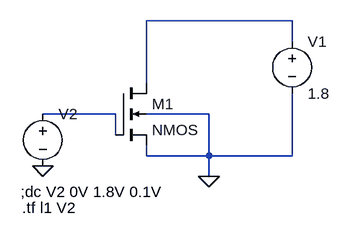
[diagram p0: schematic learning.asc]
learning.asc, the LTspice schematic file:
Version 4
SHEET 1 880 680
WIRE 384 32 160 32
WIRE 384 64 384 32
WIRE 160 128 160 32
WIRE 112 176 0 176
WIRE 256 176 160 176
WIRE 112 208 112 176
WIRE 160 240 160 224
WIRE 256 240 256 176
WIRE 256 240 160 240
WIRE 384 240 384 144
WIRE 384 240 256 240
WIRE 256 272 256 240
FLAG 256 272 0
FLAG 0 256 0
SYMBOL nmos4 112 128 R0
SYMATTR InstName M1
SYMATTR Value2 l=180 w=400
SYMBOL voltage 384 48 R0
WINDOW 123 0 0 Left 0
WINDOW 39 0 0 Left 0
SYMATTR InstName V1
SYMATTR Value 1.8
SYMBOL voltage 0 160 R0
WINDOW 123 0 0 Left 0
WINDOW 39 0 0 Left 0
SYMATTR InstName V2
SYMATTR Value ""
TEXT -34 296 Left 2 !;dc V2 0V 1.8V 0.1V
TEXT -32 320 Left 2 !.tf l1 V2

The netlist it stands for:
* learning.asc
M1 N001 N002 0 0 NMOS l=180 w=400
V1 N001 0 1.8
V2 N002 0
.model NMOS NMOS
.model PMOS PMOS
.lib standard.mos
;dc V2 0V 1.8V 0.1V
.tf l1 V2
.backanno
.end